# Altium schematic sheet Schematic.SchDoc: 1.25V_to3.75V_power_supply
size 431 x 279 mm; Date: 2022-2-18; CheckedBy: SC; CompanyName: PrivateAB; DrawnBy: SC; Engineer: Sefik Ceric; Organization: AB; DocumentNumber: SC_000001; SheetNumber: 1; SheetTotal: 1; REV: 1; Application_BuildNumber: ABN_000001
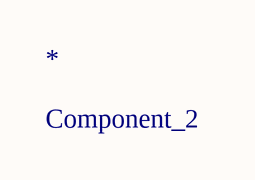
[diagram p0: Schematic.SchDoc]

## Parts
*  Component_2

## Notes on the sheet
- DWG. NO.
- REV.
- SHT.
- THIS DOCUMENT AND THE DATA DISCLOSED HEREIN OR HEREWITH IS THE PROPERTY OF ALTIUM LIMITED AND MAY BE FREELY DISTRIBUTED IN WHOLE. NO RIGHTS ARE RESERVED OR EXPRESS OR IMPLIED WARANTEE GIVEN.
- REVISION
- DESCRIPTION
- DATE
- APPROVED
- ENG:
- APPROVALS
- PROJECT
- DSN:
- CHK:
- REFERENCE DOCUMENTS
- PROJECT REVISION:
- TITLE
- DOCUMENT REVISION:
- DESIGN ITEM:
- BOM:
- FAB DWG:
- PCB DWG:
- ASSY DWG:
- SCALE:
- SIZE
- B
- CAGE CODE
- FILE NAME
- DWG NO.
- SHEET
- OF
- REV